# EAGLE design rascsi_din (EAGLE 8.0.1)
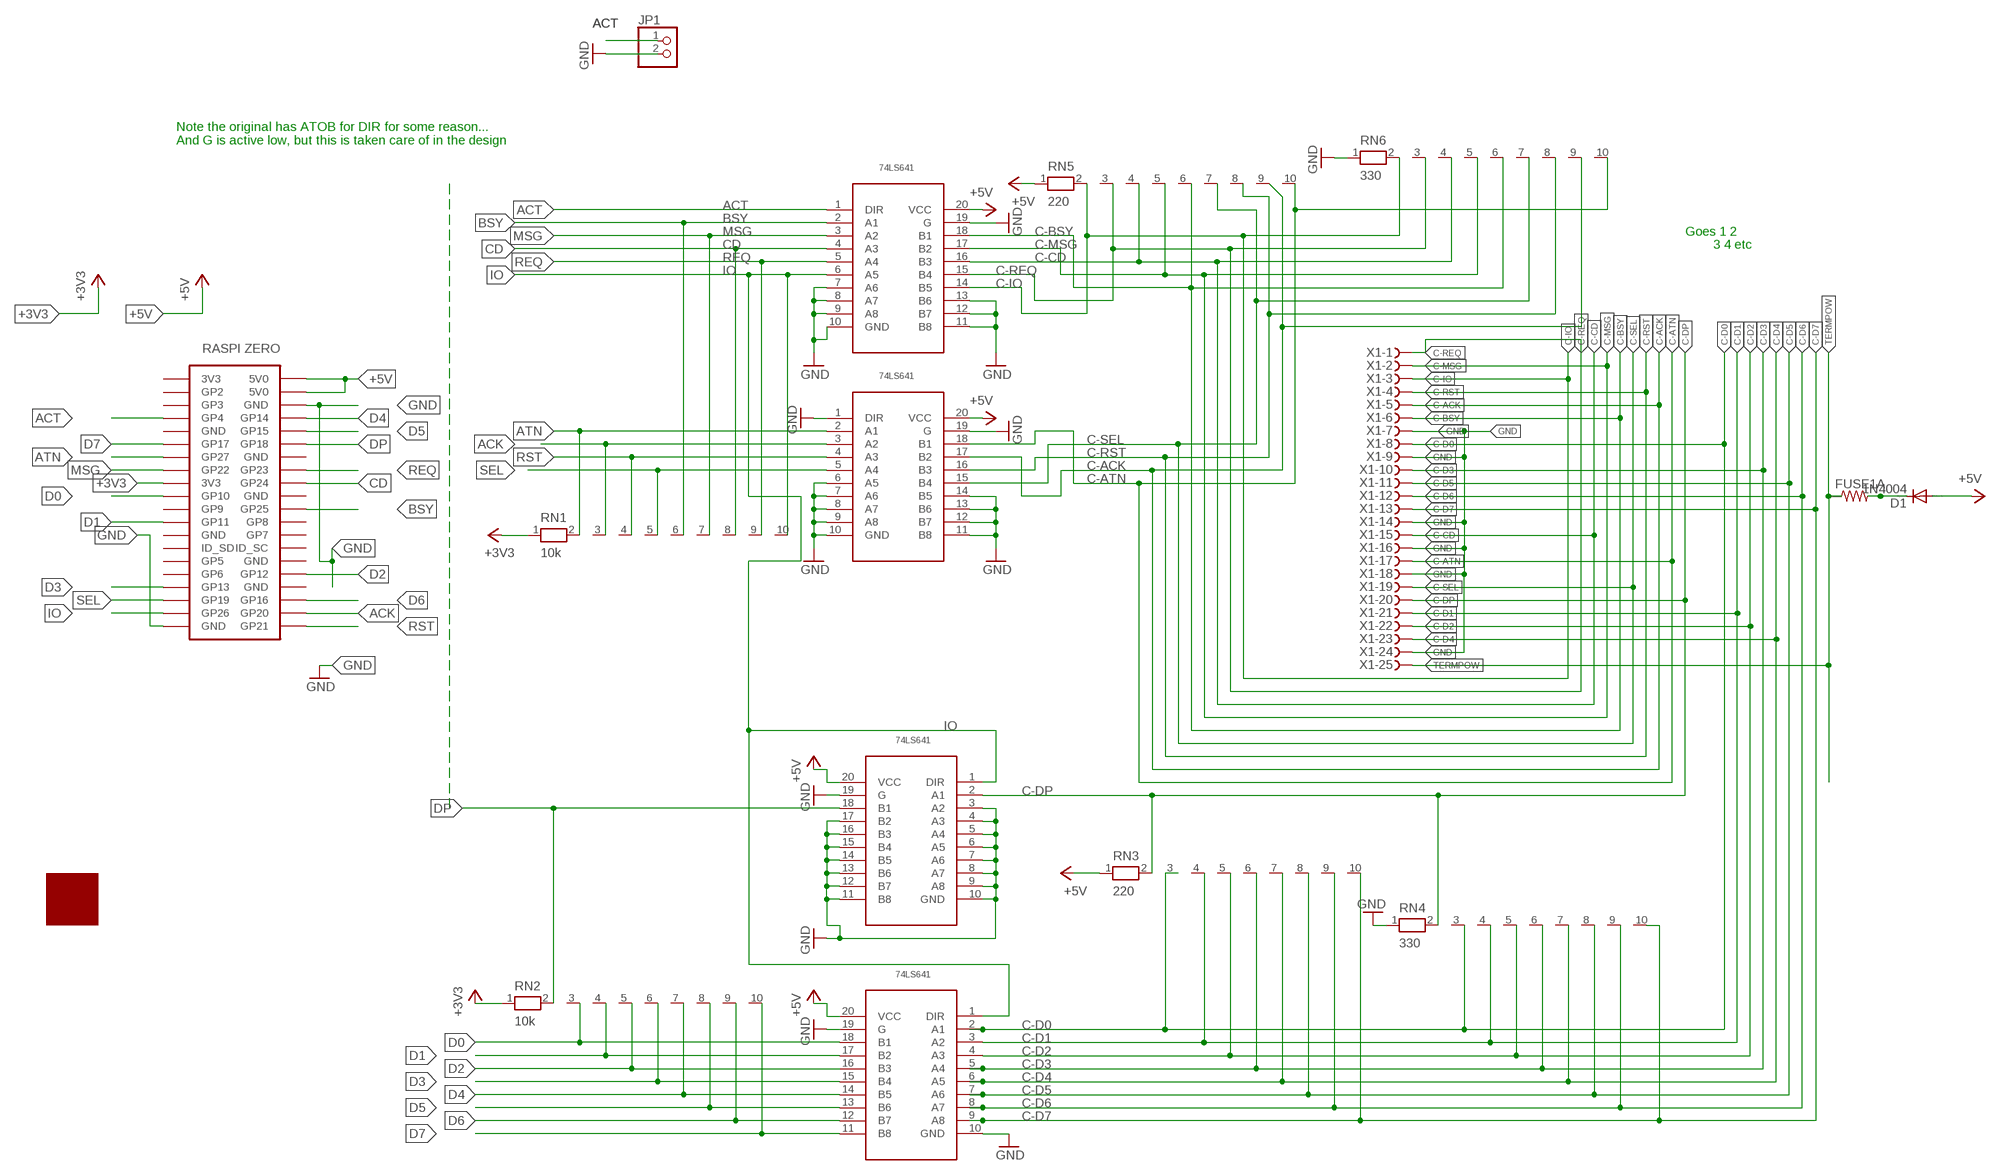
[diagram p0: schematic, sheet 1]

## Parts
D1  1N4004  [DO41-10]
FUSE1A  R-US_0204/7  [0204/7]
JP1  PINHD-1X2  [1X02]
RN1  10k  RN09  [RN-10]
RN2  10k  RN09  [RN-10]
RN3  220  RN09  [RN-10]
RN4  330  RN09  [RN-10]
RN5  220  RN09  [RN-10]
RN6  330  RN09  [RN-10]
U11  SN74LS641-1SC  [SOIC20S]
U22  SN74LS641-1SC  [SOIC20S]
U33  SN74LS641-1SC  [SOIC20S]
U44  SN74LS641-1SC  [SOIC20S]
U$1  ZERO  [ZERO]
U$2  LOGO  [LOGO]
X1  F25HPS  [F25HP]

## Nets
+3V3: RN1.1 RN2.1 U$1.17(3V3)
+5V: D1.A RN3.1 RN5.1 U11.20(VCC) U22.20(VCC) U33.20(VCC) U44.20(VCC) U$1.2(5V0) U$1.4(5V0)
ACK: RN1.3 U22.3(A2) U$1.38(GP20)
ACT: JP1.1 U11.1(DIR) U$1.7(GP4)
ATN: RN1.2 U22.2(A1) U$1.13(GP27)
BSY: RN1.6 U11.2(A1) U$1.22(GP25)
C-ACK: RN5.9 RN6.9 U22.17(B2) X1.5
C-ATN: RN5.10 RN6.10 U22.18(B1) X1.17
C-BSY: RN5.6 RN6.6 U11.18(B1) X1.6
C-CD: RN5.4 RN6.4 U11.16(B3) X1.15
C-D0: RN3.3 RN4.3 U44.2(A1) X1.8
C-D1: RN3.4 RN4.4 U44.3(A2) X1.21
C-D2: RN3.5 RN4.5 U44.4(A3) X1.22
C-D3: RN3.6 RN4.6 U44.5(A4) X1.10
C-D4: RN3.7 RN4.7 U44.6(A5) X1.23
C-D5: RN3.8 RN4.8 U44.7(A6) X1.11
C-D6: RN3.9 RN4.9 U44.8(A7) X1.12
C-D7: RN3.10 RN4.10 U44.9(A8) X1.13
C-DP: RN3.2 RN4.2 U33.2(A1) X1.20
C-IO: RN5.2 RN6.2 U11.14(B5) X1.3
C-MSG: RN5.5 RN6.5 U11.17(B2) X1.2
C-REQ: RN5.3 RN6.3 U11.15(B4) X1.1
C-RST: RN5.8 RN6.8 U22.16(B3) X1.4
C-SEL: RN5.7 RN6.7 U22.15(B4) X1.19
CD: RN1.8 U11.4(A3) U$1.18(GP24)
D0: RN2.3 U44.18(B1) U$1.19(GP10)
D1: RN2.4 U44.17(B2) U$1.23(GP11)
D2: RN2.5 U44.16(B3) U$1.32(GP12)
D3: RN2.6 U44.15(B4) U$1.33(GP13)
D4: RN2.7 U44.14(B5) U$1.8(GP14)
D5: RN2.8 U44.13(B6) U$1.10(GP15)
D6: RN2.9 U44.12(B7) U$1.36(GP16)
D7: RN2.10 U44.11(B8) U$1.11(GP17)
DP: RN2.2 U33.18(B1) U$1.12(GP18)
GND: JP1.2 RN4.1 RN6.1 U11.7(A6) U11.8(A7) U11.9(A8) U11.10(GND) U11.11(B8) U11.12(B7) U11.13(B6) U11.19(G) U22.1(DIR) U22.6(A5) U22.7(A6) U22.8(A7) U22.9(A8) U22.10(GND) U22.11(B8) U22.12(B7) U22.13(B6) U22.14(B5) U22.19(G) U33.3(A2) U33.4(A3) U33.5(A4) U33.6(A5) U33.7(A6) U33.8(A7) U33.9(A8) U33.10(GND) U33.11(B8) U33.12(B7) U33.13(B6) U33.14(B5) U33.15(B4) U33.16(B3) U33.17(B2) U33.19(G) U44.10(GND) U44.19(G) U$1.6(GND) U$1.39(GND) X1.7 X1.9 X1.14 X1.16 X1.18 X1.24
IO: RN1.10 U11.6(A5) U33.1(DIR) U44.1(DIR) U$1.37(GP26)
MSG: RN1.7 U11.3(A2) U$1.15(GP22)
N$4: D1.C FUSE1A.2
REQ: RN1.9 U11.5(A4) U$1.16(GP23)
RST: RN1.4 U22.4(A3) U$1.40(GP21)
SEL: RN1.5 U22.5(A4) U$1.35(GP19)
TERMPOW: FUSE1A.1 X1.25
Unconnected: U$1.1(3V3) U$1.3(GP2) U$1.5(GP3) U$1.9(GND) U$1.14(GND) U$1.20(GND) U$1.21(GP9) U$1.24(GP8) U$1.25(GND) U$1.26(GP7) U$1.27(ID_SD) U$1.28(ID_SC) U$1.29(GP5) U$1.30(GND) U$1.31(GP6) U$1.34(GND)

## Notes on the sheet
- Note the original has ATOB for DIR for some reason...
  And G is active low, but this is taken care of in the design
- Goes 1 2
- 3 4 etc

## Library data of the parts
D1 = diode:1N4004: DIODE general purpose rectifier, 1 A
FUSE1A = resistor:R-US_: RESISTOR, American symbol
JP1 = pinhead:PINHD-1X2: PIN HEADER
RN1-RN6 = resistor-net:RN09: RESISTOR NETWORK; OC_FARNELL: unknown; OC_NEWARK: unknown
U11 U22 U33 U44 = capstuff:SN74LS641-1: Octual Bus Trans.
U$1 = RasPi:ZERO: Raspbery Pi Foundation Zero https://www.raspberrypi.org/products/pi-zero/
U$2 = capstuff:LOGO
X1 = con-subd:F25?S: SUB-D; OC_FARNELL: unknown; OC_NEWARK: unknown

## Board
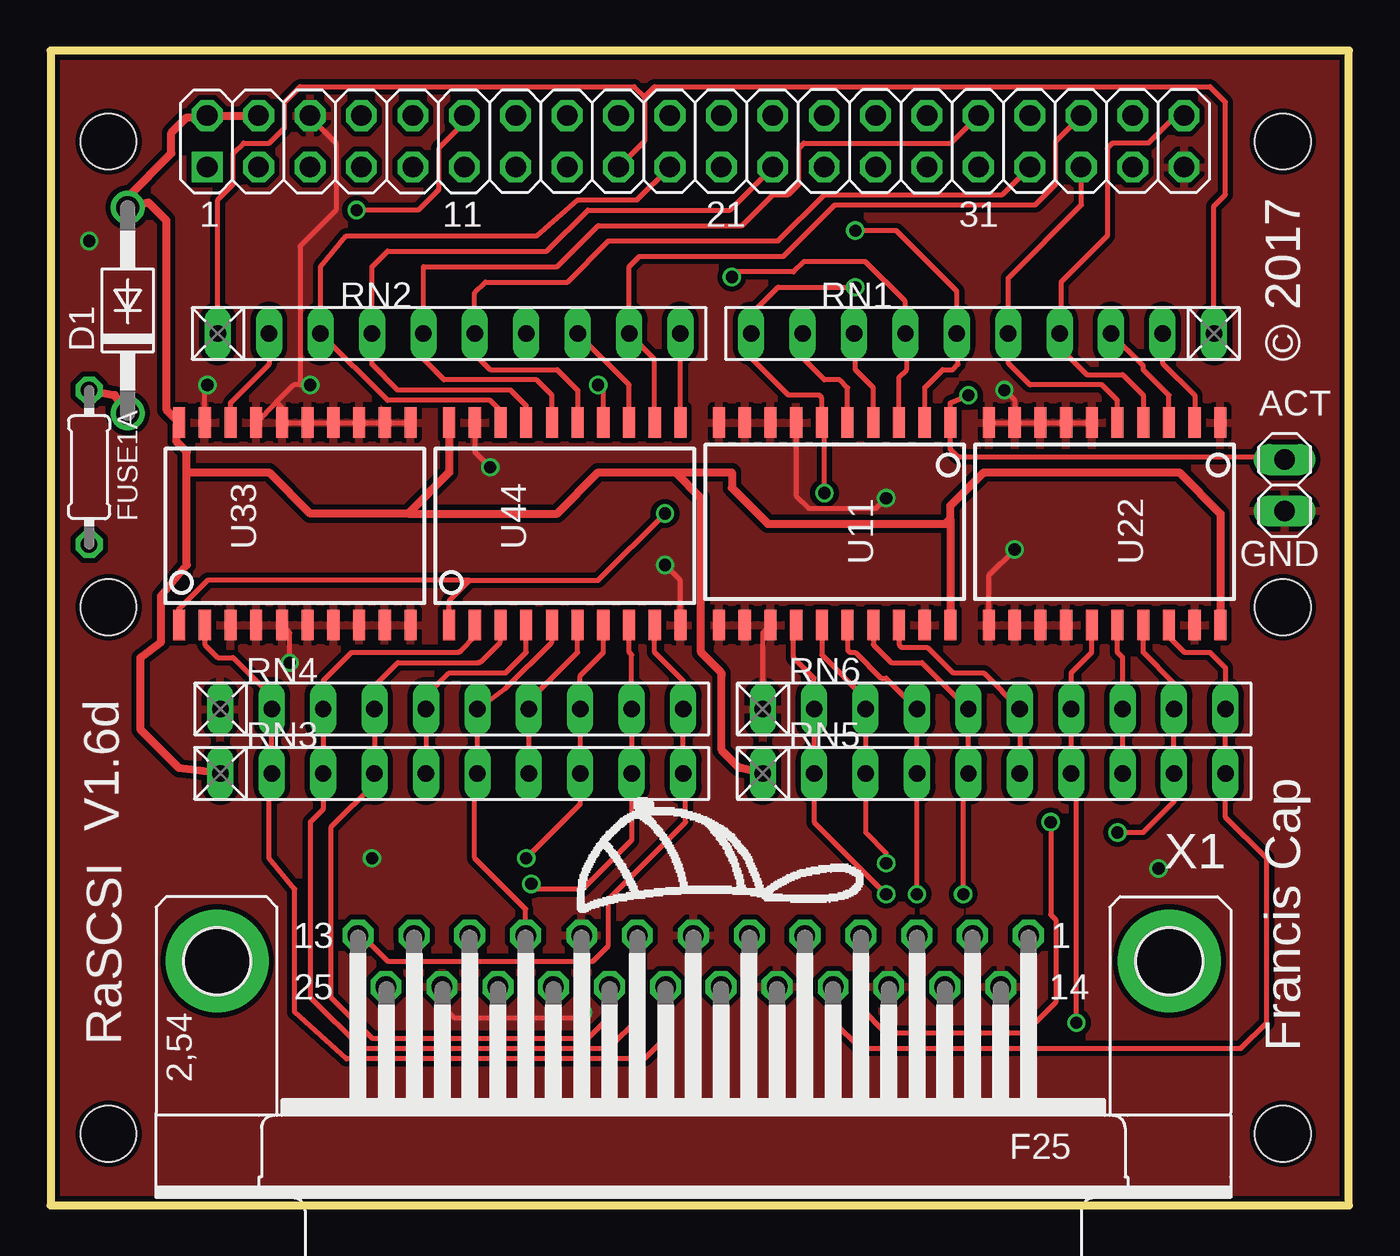
[diagram p1: board, top side]
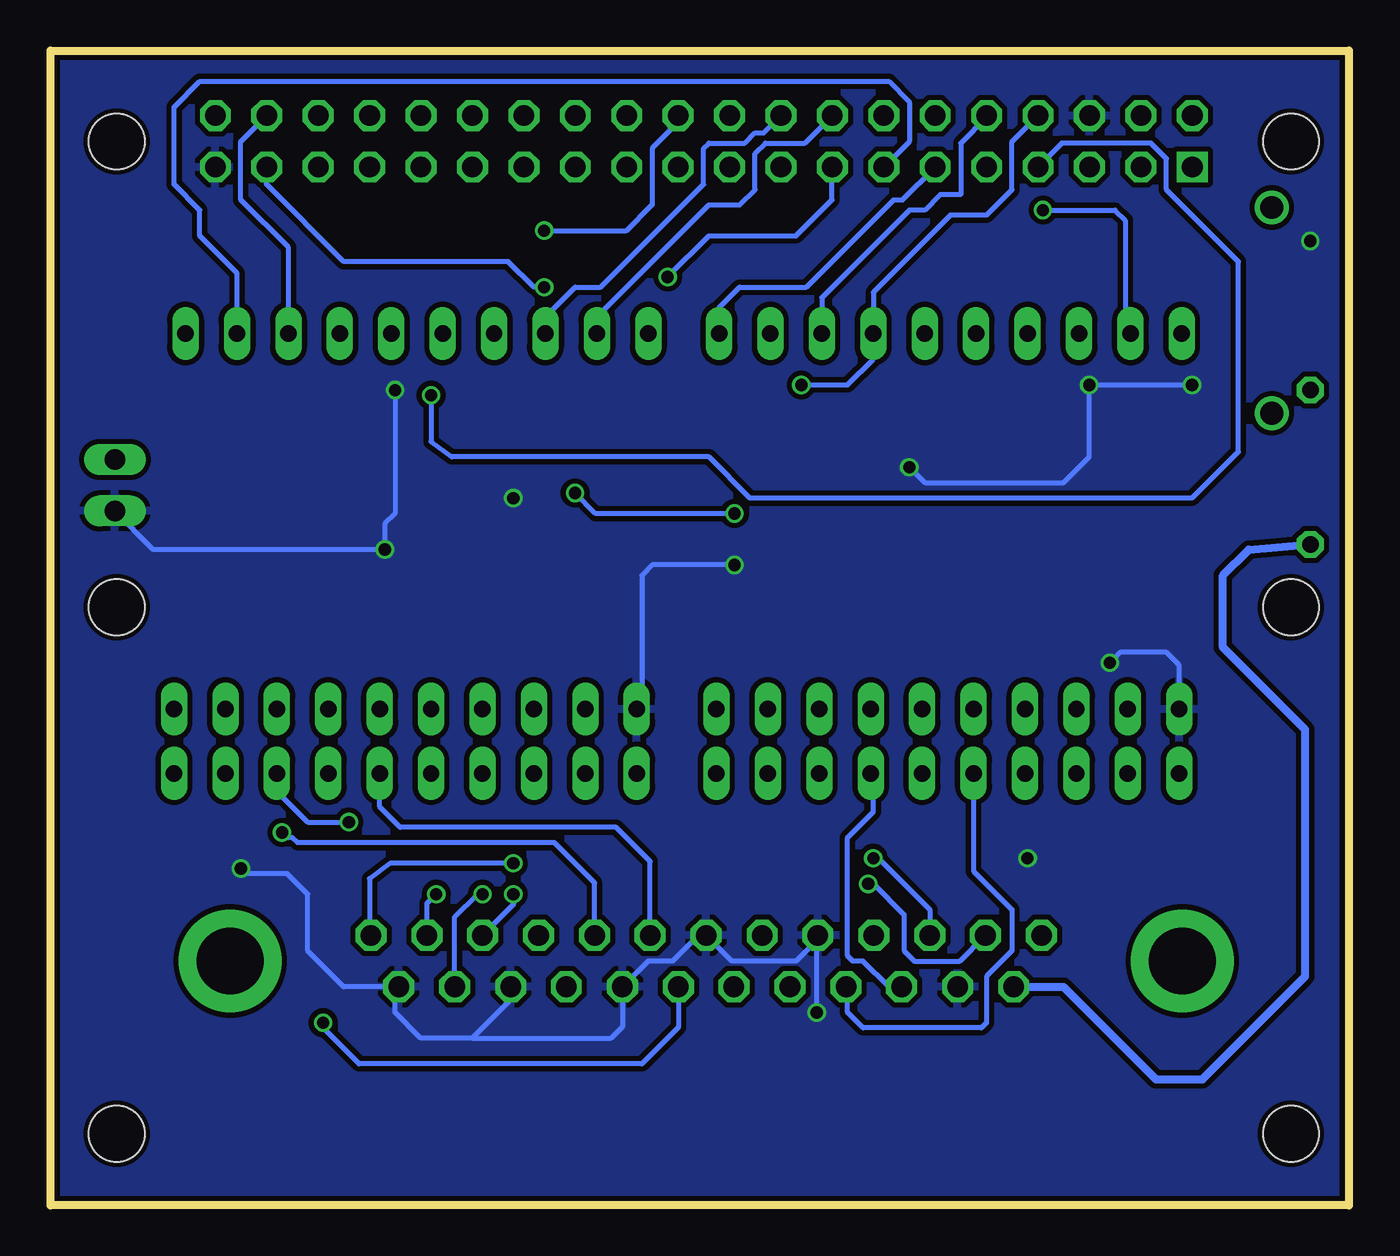
[diagram p2: board, bottom side, seen from below]

Size 64.13 x 57.02 mm. Coordinates in mm from the lower left corner, seen from the top.
Outline: 0,57.02 0,0 64.13,0 64.13,57.02 0,57.02
Copper layers (1*16): Top 0.035mm / dielectric 1.5mm / Bottom 0.035mm
Design rules "dirt_cheap_dirty_boards.v1": minimum track width 5mil, minimum drill 12mil, track to track 5mil, track to pad 5mil, pad to pad 5mil, via to via 5mil, smd to smd 0mil, copper to edge 10mil, drill to drill 10mil, minimum pad ring 10mil, minimum via ring 6mil, stop-mask expansion 2mil, vias tented up to drill 25mil, thermal gap 10mil

### Footprints (pad centres in the part's own frame; a part is rotated, then mirrored left to right if it is on the bottom)
DO41-10 = drill 1.118: A 5.08,0; C -5.08,0
0204/7 = drill 0.813 octagon: 1 -3.81,0; 2 3.81,0
1X02 = drill 1.016 long: 1 -1.27,0; 2 1.27,0
RN-10 = drill 0.813 long: 1 -11.43,0; 2 -8.89,0; 3 -6.35,0; 4 -3.81,0; 5 -1.27,0; 6 1.27,0; 7 3.81,0; 8 6.35,0; 9 8.89,0; 10 11.43,0
SOIC20S = smd 0.6 x 1.5: 1 -5.715,-5; 2 -4.445,-5; 3 -3.175,-5; 4 -1.905,-5; 5 -0.635,-5; 6 0.635,-5; 7 1.905,-5; 8 3.175,-5; 9 4.445,-5; 10 5.715,-5; 11 5.715,5; 12 4.445,5; 13 3.175,5; 14 1.905,5; 15 0.635,5; 16 -0.635,5; 17 -1.905,5; 18 -3.175,5; 19 -4.445,5; 20 -5.715,5
ZERO = drill 1.016 square: 1 8.37,25.24 | drill 1.016 octagon: 2 8.37,27.78; 3 10.91,25.24; 4 10.91,27.78; 5 13.45,25.24; 6 13.45,27.78; 7 15.99,25.24; 8 15.99,27.78; 9 18.53,25.24; 10 18.53,27.78; 11 21.07,25.24; 12 21.07,27.78; 13 23.61,25.24; 14 23.61,27.78; 15 26.15,25.24; 16 26.15,27.78; 17 28.69,25.24; 18 28.69,27.78; 19 31.23,25.24; 20 31.23,27.78; 21 33.77,25.24; 22 33.77,27.78; 23 36.31,25.24; 24 36.31,27.78; 25 38.85,25.24; 26 38.85,27.78; 27 41.39,25.24; 28 41.39,27.78; 29 43.93,25.24; 30 43.93,27.78; 31 46.47,25.24; 32 46.47,27.78; 33 49.01,25.24; 34 49.01,27.78; 35 51.55,25.24; 36 51.55,27.78; 37 54.09,25.24; 38 54.09,27.78; 39 56.63,25.24; 40 56.63,27.78 | hole 2.75: 3.5,3.5; 3.5,26.5; 61.5,26.5; 61.5,3.5; 3.5,-22.5; 61.5,-22.5
F25HP = drill 1.016 octagon: 1 -16.561,-1.27; 2 -13.792,-1.27; 3 -11.049,-1.27; 4 -8.28,-1.27; 5 -5.512,-1.27; 6 -2.769,-1.27; 7 0,-1.27; 8 2.769,-1.27; 9 5.512,-1.27; 10 8.28,-1.27; 11 11.049,-1.27; 12 13.792,-1.27; 13 16.561,-1.27; 14 -15.189,1.27; 15 -12.421,1.27; 16 -9.652,1.27; 17 -6.909,1.27; 18 -4.14,1.27; 19 -1.372,1.27; 20 1.372,1.27; 21 4.14,1.27; 22 6.909,1.27; 23 9.652,1.27; 24 12.421,1.27; 25 15.189,1.27 | drill 3.302 pad 5.08: G1 -23.52,0; G2 23.52,0

### Placement (x,y rotation side)
D1  3.81,44.2 90 top
FUSE1A  1.91,36.45 90 top
JP1  60.96,35.56 270 top
RN1  46.04,43.05 180 top
RN2  19.68,43.05 0 top
RN3  19.81,21.34 0 top
RN4  19.81,24.51 0 top
RN5  46.61,21.34 0 top
RN6  46.61,24.51 0 top
U11  38.73,33.66 180 top
U22  52.07,33.66 180 top
U33  12.07,33.66 0 top
U44  25.4,33.66 0 top
U$1  -0.63,26.03 0 top
U$2  25.97,14.41 0 top
X1  31.75,12.06 180 top

### Tracks (layer width: path | path; a pad name or v marks a point on that pad's centre or on a via)
+3V3
  Top 0.254: RN2.1 8.26,49.66 9.02,50.42 9.02,51.94 9.53,52.45 10.8,52.45 11.56,53.21 11.56,54.48 12.32,55.24 28.83,55.24 29.34,54.74 | 29.34,54.74 29.34,52.56 U$1.17 | RN1.1 57.47,49.34 58.04,49.91 58.04,54.48 57.28,55.24 29.85,55.24 29.34,54.74
+5V
  Top 0.406: U$1.4 U$1.2 7.64,53.72 6.73,53.72 5.97,52.96 5.97,51.94 3.81,49.78 D1.A 4.83,49.53 5.71,48.64 5.71,39.29 U33.20 6.22,38.53 6.22,37.72 6.73,37.21 6.73,36.2 | RN3.1 6.35,21.59 4.45,23.49 4.45,27.05 5.46,27.81 5.46,30.1 6.73,31.62 6.73,36.2 | 6.73,36.2 10.8,36.2 12.83,34.16 17.65,34.16 | 30.86,36.2 33.66,36.2 33.66,35.43 35.43,33.66 44.2,33.66 44.45,33.91 | 30.86,36.2 27.05,36.2 25.02,34.16 17.65,34.16 | U22.20 57.78,34.16 55.75,36.2 46.1,36.2 44.45,34.54 44.45,33.91 | 44.45,33.91 U11.20 | 30.86,36.2 32.13,34.92 32.13,27.3 33.07,26.36 arc-45 33.15,26.18 33.15,22.48 33.96,21.66 arc45 34.14,21.59 RN5.1 | U44.20 19.68,36.2 17.65,34.16
ACK
  Top 0.254: U22.3 55.25,40 53.97,41.27 53.97,41.47 RN1.3
  Bottom 0.254: RN1.3 52.39,47.31 54.74,49.66 54.74,52.53 U$1.38
ACT  (via drill 0.6)
  Top 0.254: JP1.1 60.83,36.96 44.83,36.96 44.45,37.34 U11.1 44.45,39.62 v45.34,40
  Bottom 0.254: v45.34,40 45.34,37.72 44.32,36.96 31.62,36.96 29.59,34.92 7.75,34.92 5.46,37.21 5.46,46.61 9.02,50.16 9.02,51.69 9.78,52.45 14.18,52.45 U$1.7
ATN
  Top 0.254: RN1.2 54.93,41.59 56.52,40 U22.2
  Bottom 0.254: RN1.2 54.93,46.04 56.77,47.88 56.77,49.15 58.04,50.42 58.04,54.23 56.77,55.5 22.73,55.5 21.72,54.48 21.72,52.53 U$1.13
BSY  (via drill 0.6)
  Top 0.254: U11.2 43.18,40.39 44.07,41.27 44.58,41.27 44.83,41.53 44.83,42.99 RN1.6 44.77,45.15 41.78,48.13 v39.75,48.13
  Bottom 0.254: U$1.22 33.14,53.48 34.42,52.2 34.42,49.4 35.69,48.13 v39.75,48.13 | 44.83,43.12 RN1.6
C-ACK  (via drill 0.6)
  Top 0.254: U22.17 53.97,27.3 55.5,25.78 RN6.9 RN5.9 55.5,19.94 53.97,18.41 v52.7,18.41
  Bottom 0.254: X1.5 37.26,15.93 39.24,17.91 51.94,17.91 52.2,18.16 52.45,18.16 v52.7,18.41
C-ATN
  Top 0.254: U22.18 55.25,28.07 56.01,27.3 57.28,27.3 58.04,26.54 RN6.10 RN5.10 58.04,19.18 60.07,17.14 60.07,9.02 58.8,7.75 40,7.75 38.66,9.09 X1.17
C-BSY
  Top 0.254: RN5.6 RN6.6 46.1,26.29 44.58,26.29 43.31,27.56 42.04,27.56 41.91,27.69 U11.18
  Bottom 0.254: X1.6 34.52,16.99 36.19,18.67 46.86,18.67 47.88,19.68 RN5.6
C-CD  (via drill 0.6)
  Top 0.254: U11.16 39.37,27.43 39.5,27.3 39.75,27.3 41.02,26.03 41.28,26.03 RN6.4 RN5.4 v42.8,15.37
  Bottom 0.254: X1.15 44.17,14.25 43.05,15.37 v42.8,15.37
C-D0
  Top 0.254: U44.2 20.96,28.07 20.27,27.38 arc-45 20.09,27.3 14.86,27.3 13.54,25.98 arc45 13.46,25.8 RN4.3 RN3.3 13.46,19.56 12.83,18.92 12.83,10.29 15.37,7.75 27.56,7.75 29.08,9.27 29.08,13.23 X1.8
C-D1
  Top 0.254: U44.3 22.23,27.81 21.28,26.87 arc-45 21.1,26.8 17.14,26.8 16.08,25.73 arc45 16,25.55 RN4.4 RN3.4 16,20.83 13.84,18.67 13.84,10.29 15.88,8.25 26.54,8.25 27.56,9.27 27.56,10.74 X1.21
C-D2
  Top 0.254: U44.4 23.5,27.3 22.48,26.29 19.68,26.29 18.62,25.22 arc45 18.54,25.04 RN4.5 RN3.5
  Bottom 0.254: RN3.5 18.54,16.51 16.64,14.6 16.64,12.57 17.91,11.3 17.91,9.02 18.16,8.76 24,8.76 24.77,9.52 24.77,10.72 X1.22
C-D3
  Top 0.254: U44.5 24.77,27.81 22.48,25.53 RN4.6 RN3.6 20.96,21.21 20.96,17.14 23.47,14.63 X1.10
C-D4
  Top 0.254: U44.6 26.04,27.3 23.62,24.89 RN4.7 RN3.7
  Bottom 0.254: X1.23 22.73,10.8 24,12.06 24.51,12.06 24.77,12.32 24.77,18.16 23.5,19.43 23.5,21.21 RN3.7
C-D5  (via drill 0.6)
  Top 0.254: U44.7 27.31,27.3 26.16,26.16 RN4.8 RN3.8 26.16,19.81 v23.5,17.14
  Bottom 0.254: v23.5,17.14 23.24,17.14 20.7,14.6 X1.11
C-D6  (via drill 0.6)
  Top 0.254: U44.8 28.57,27.3 28.7,27.18 RN4.9 RN3.9 28.7,18.03 26.29,15.62 24,15.62 v23.75,15.88
  Bottom 0.254: v23.75,15.88 23.5,15.88 21.97,14.35 21.97,12.57 21.46,12.06 19.23,12.06 X1.12
C-D7
  Top 0.254: U44.9 29.85,27.3 31.24,25.91 RN4.10 RN3.10 31.37,21.21 31.37,18.92 27.56,15.11 27.56,12.83 26.8,12.06 16.64,12.06 15.37,13.34 X1.13 15.19,13.41
C-DP
  Top 0.254: U33.2 7.62,27.69 8.26,27.05 9.02,27.05 10.92,25.15 RN4.2 RN3.2 10.8,21.21 10.8,17.14 12.07,15.62 12.07,9.52 14.61,7.24 29.34,7.24 30.38,8.28 X1.20
C-IO  (via drill 0.6)
  Top 0.254: U11.14 36.7,28.53 36.7,27.05 37.72,26.03 RN6.2 RN5.2 37.72,18.92 v41.28,15.37
  Bottom 0.254: v41.28,15.37 41.28,14.86 X1.3
C-MSG  (via drill 0.6)
  Top 0.254: U11.17 40.64,27.69 41.53,26.8 43.05,26.8 RN6.5 RN5.5 45.08,21.08 v45.08,15.37
  Bottom 0.254: X1.2 45.54,14.91 v45.08,15.37
C-REQ  (via drill 0.6)
  Top 0.254: U11.15 38.1,27.18 40.26,25.02 RN6.3 RN5.3 40.26,18.41 41.28,17.4 v41.28,16.89
  Bottom 0.254: v41.28,16.89 47.37,16.89 48.39,16.13 48.39,13.41 X1.1
C-RST  (via drill 0.6)
  Top 0.254: RN5.8 RN6.8 52.96,27.05 52.7,27.3 U22.16 | v49.4,18.92 49.4,14.35 49.66,14.1 49.66,10.03 48.13,8.51 41.28,8.51 40,9.78 40,13.31 X1.4
  Bottom 0.254: RN5.8 52.96,20.45 51.44,18.92 v49.4,18.92
C-SEL  (via drill 0.6)
  Top 0.254: U22.15 51.44,27.3 50.42,26.29 RN6.7 RN5.7 50.67,21.08 v50.67,9.02
  Bottom 0.254: X1.19 33.12,8.79 34.92,6.98 48.89,6.98 50.67,8.76 v50.67,9.02
CD
  Top 0.254: U11.4 40.64,40.39 39.75,41.27 39.75,42.99 RN1.8
  Bottom 0.254: RN1.8 39.69,43.88 38.23,45.34 36.96,45.34 31.88,50.42 31.88,52.2 31.62,52.45 29.85,52.45 29.34,52.96 28.91,52.96 U$1.18
D0
  Top 0.254: U44.18 22.23,39.24 21.72,39.75 16.64,39.75 RN2.3 13.34,46.35 14.61,47.88 24,47.88 26.04,49.66 28.98,49.66 U$1.19
D1
  Top 0.254: U44.17 23.5,39.5 22.73,40.26 17.14,40.26 15.88,41.53 RN2.4 15.88,46.35 16.64,47.12 24.51,47.12 26.54,49.15 33.55,49.15 U$1.23
D2
  Top 0.254: U44.16 24.77,40 24,40.77 19.43,40.77 18.41,41.78 RN2.5 18.41,46.35 25.02,46.35 27.05,48.39 34.16,48.39 35.69,49.91 36.45,49.91 36.96,50.42 36.96,52.2 37.21,52.45 44.47,52.45 U$1.32
D3
  Top 0.254: U44.15 26.04,40.26 25.02,41.27 21.72,41.27 20.96,42.04 RN2.6 20.96,45.09 21.46,45.59 25.53,45.59 27.56,47.62 35.94,47.62 38.23,49.91 47.01,49.91 U$1.33
D4  (via drill 0.6)
  Top 0.254: U44.14 27.31,40.26 v27.05,40.51
  Bottom 0.254: v27.05,40.51 24.77,40.51 23.5,41.78 RN2.7 23.5,45.09 19.68,48.9 17.91,48.9 16.64,50.16 16.64,52.53 U$1.8
D5
  Top 0.254: U44.13 28.57,40.51 RN2.8
  Bottom 0.254: U$1.10 17.89,53.73 19.18,52.45 19.18,49.91 20.19,49.91 20.96,49.15 21.72,49.15 26.04,44.83 RN2.8
D6
  Top 0.254: U44.12 29.85,41.78 RN2.9 28.57,46.35 29.08,46.86 36.19,46.86 38.73,49.4 48.64,49.4 49.66,50.42 49.66,52.56 U$1.36
D7
  Top 0.254: U44.11 RN2.10
  Bottom 0.254: RN2.10 31.11,44.32 30.1,45.34 26.8,45.34 22.48,49.66 22.05,49.66 U$1.11
DP  (via drill 0.6)
  Top 0.254: U33.18 8.89,39.62 10.8,41.53 RN2.2 | U$1.12 20.43,53.46 19.18,52.2 19.18,50.16 18.16,49.15 v15.11,49.15
  Bottom 0.254: v15.11,49.15 11.56,49.15 11.05,48.64 11.05,43.31 RN2.2
GND  (via drill 0.6)
  Top 0.254: v11.81,26.8 11.81,28.27 U33.5 | X1.24 19.33,9.88 19.94,9.27 26.04,9.27 v26.29,9.52 | RN6.1 35.18,28.27 U11.13 | U44.10 31.11,30.86 v30.35,31.62 | U22.11 46.36,31.12 v47.62,32.38 | U22.9 47.62,39.75 v47.12,40.26 | U22.10 U22.9 | U22.9 U22.8 U22.7 U22.6 | U33.19 7.62,40.39 v7.75,40.51 | 12.32,40.51 v12.83,40.51 | 12.32,40.51 12.02,40.51 11.15,39.65 | 11.15,39.65 U33.17 | 11.15,39.65 11.43,39.37 U33.16 U33.15 U33.14 U33.13 U33.12 U33.11 | U$1.6 12.82,53.73 14.1,52.45 14.1,49.15 12.32,47.37 12.32,40.51 | U44.19 20.96,37.21 v21.72,36.45 | U11.7 36.83,35.05 37.47,34.42 40.77,34.42 v41.28,34.92
  Bottom 0.254: RN4.1 8.38,26.67 9.02,27.3 11.3,27.3 v11.81,26.8 | v26.29,9.52 26.29,13.28 X1.9 26.24,13.13 27.31,12.06 30.48,12.06 X1.7 32.13,13.34 33.4,12.06 34.62,12.06 X1.18 35.89,8.81 36.45,8.25 43.31,8.25 | v54.74,16.64 54.48,16.38 52.45,16.38 51.44,15.37 51.44,12.57 49.66,10.8 X1.14 47.12,10.62 47.12,9.52 45.85,8.25 43.31,8.25 | X1.16 41.4,10.16 43.31,8.25 | v30.35,31.62 34.42,31.62 34.92,31.12 34.92,24.77 RN6.1 | JP1.2 59.05,32.38 v47.62,32.38 47.62,33.66 47.12,34.16 v47.12,40.26 | v7.75,40.51 v12.83,40.51 12.83,36.96 14.1,35.69 20.96,35.69 v21.72,36.45
  other vias: 1.91,47.62 15.88,17.14
  pour Top (isolate 0.254): -3.96,58.83 83.67,58.83 83.41,-1.5 -4.22,-1.37
  pour Bottom (isolate 0.254): -2.06,58.52 83.44,58.52 83.19,-1.12 -2.31,-1.12
IO  (via drill 0.6)
  Top 0.254: v39.75,45.34 35.94,45.34 34.61,44.01 RN1.10 34.61,41.85 36.45,40 37.97,40 38.1,39.88 U11.6 38.23,38.53 v38.23,35.18 | U33.1 6.35,29.46 7.75,30.86 20.7,30.86 | U44.1 19.68,29.84 20.7,30.86 | 20.7,30.86 27.05,30.86 v30.35,34.16
  Bottom 0.254: v39.75,45.34 40.26,45.34 41.53,46.61 49.66,46.61 53.47,50.42 53.47,51.26 U$1.37 | v30.35,34.16 37.21,34.16 v38.23,35.18
MSG  (via drill 0.6)
  Top 0.254: U11.3 41.91,40.89 42.29,41.27 42.29,42.99 RN1.7 | RN1.7 42.23,43.62 | 33.66,46.1 v33.66,45.85 33.91,46.1 36.7,46.1 37.21,46.61 40.26,46.61 42.23,44.64 RN1.7
  Bottom 0.254: U$1.15 25.53,51.26 25.53,49.66 27.31,47.88 31.62,47.88 v33.66,45.85
N$4
  Top 0.406: FUSE1A.2 3.18,40 D1.C
REQ
  Top 0.254: U11.5 39.37,40.39 38.99,40.77 38.23,40.77 37.21,41.78 37.21,42.99 RN1.9
  Bottom 0.254: 37.15,43.62 RN1.9 37.15,43.88 31.62,49.4 30.1,49.4 29.34,50.16 29.34,51.94 28.83,52.45 26.88,52.45 U$1.16
RST
  Top 0.254: U22.4 53.97,40 52.96,41.02 51.18,41.02 49.85,42.35 RN1.4 49.91,43.12 49.91,45.59 52.2,47.88 52.2,52.2 52.45,52.45 54.23,52.45 55.59,53.82 U$1.40
SEL
  Top 0.254: U22.5 52.7,39.75 51.94,40.51 48.39,40.51 47.31,41.59 RN1.5 47.31,45.78 50.93,49.4 50.93,51.26 U$1.35
TERMPOW
  Bottom 0.406: X1.25 14.1,10.8 9.53,6.22 7.24,6.22 2.16,11.3 2.16,23.49 6.22,27.56 6.22,31.12 4.95,32.38 FUSE1A.1

### Text on the board
tPlace: ACT | GND | V1.6d | RaSCSI | Francis Cap
tNames: © 2017